# Altium project Diverter.PrjPcb
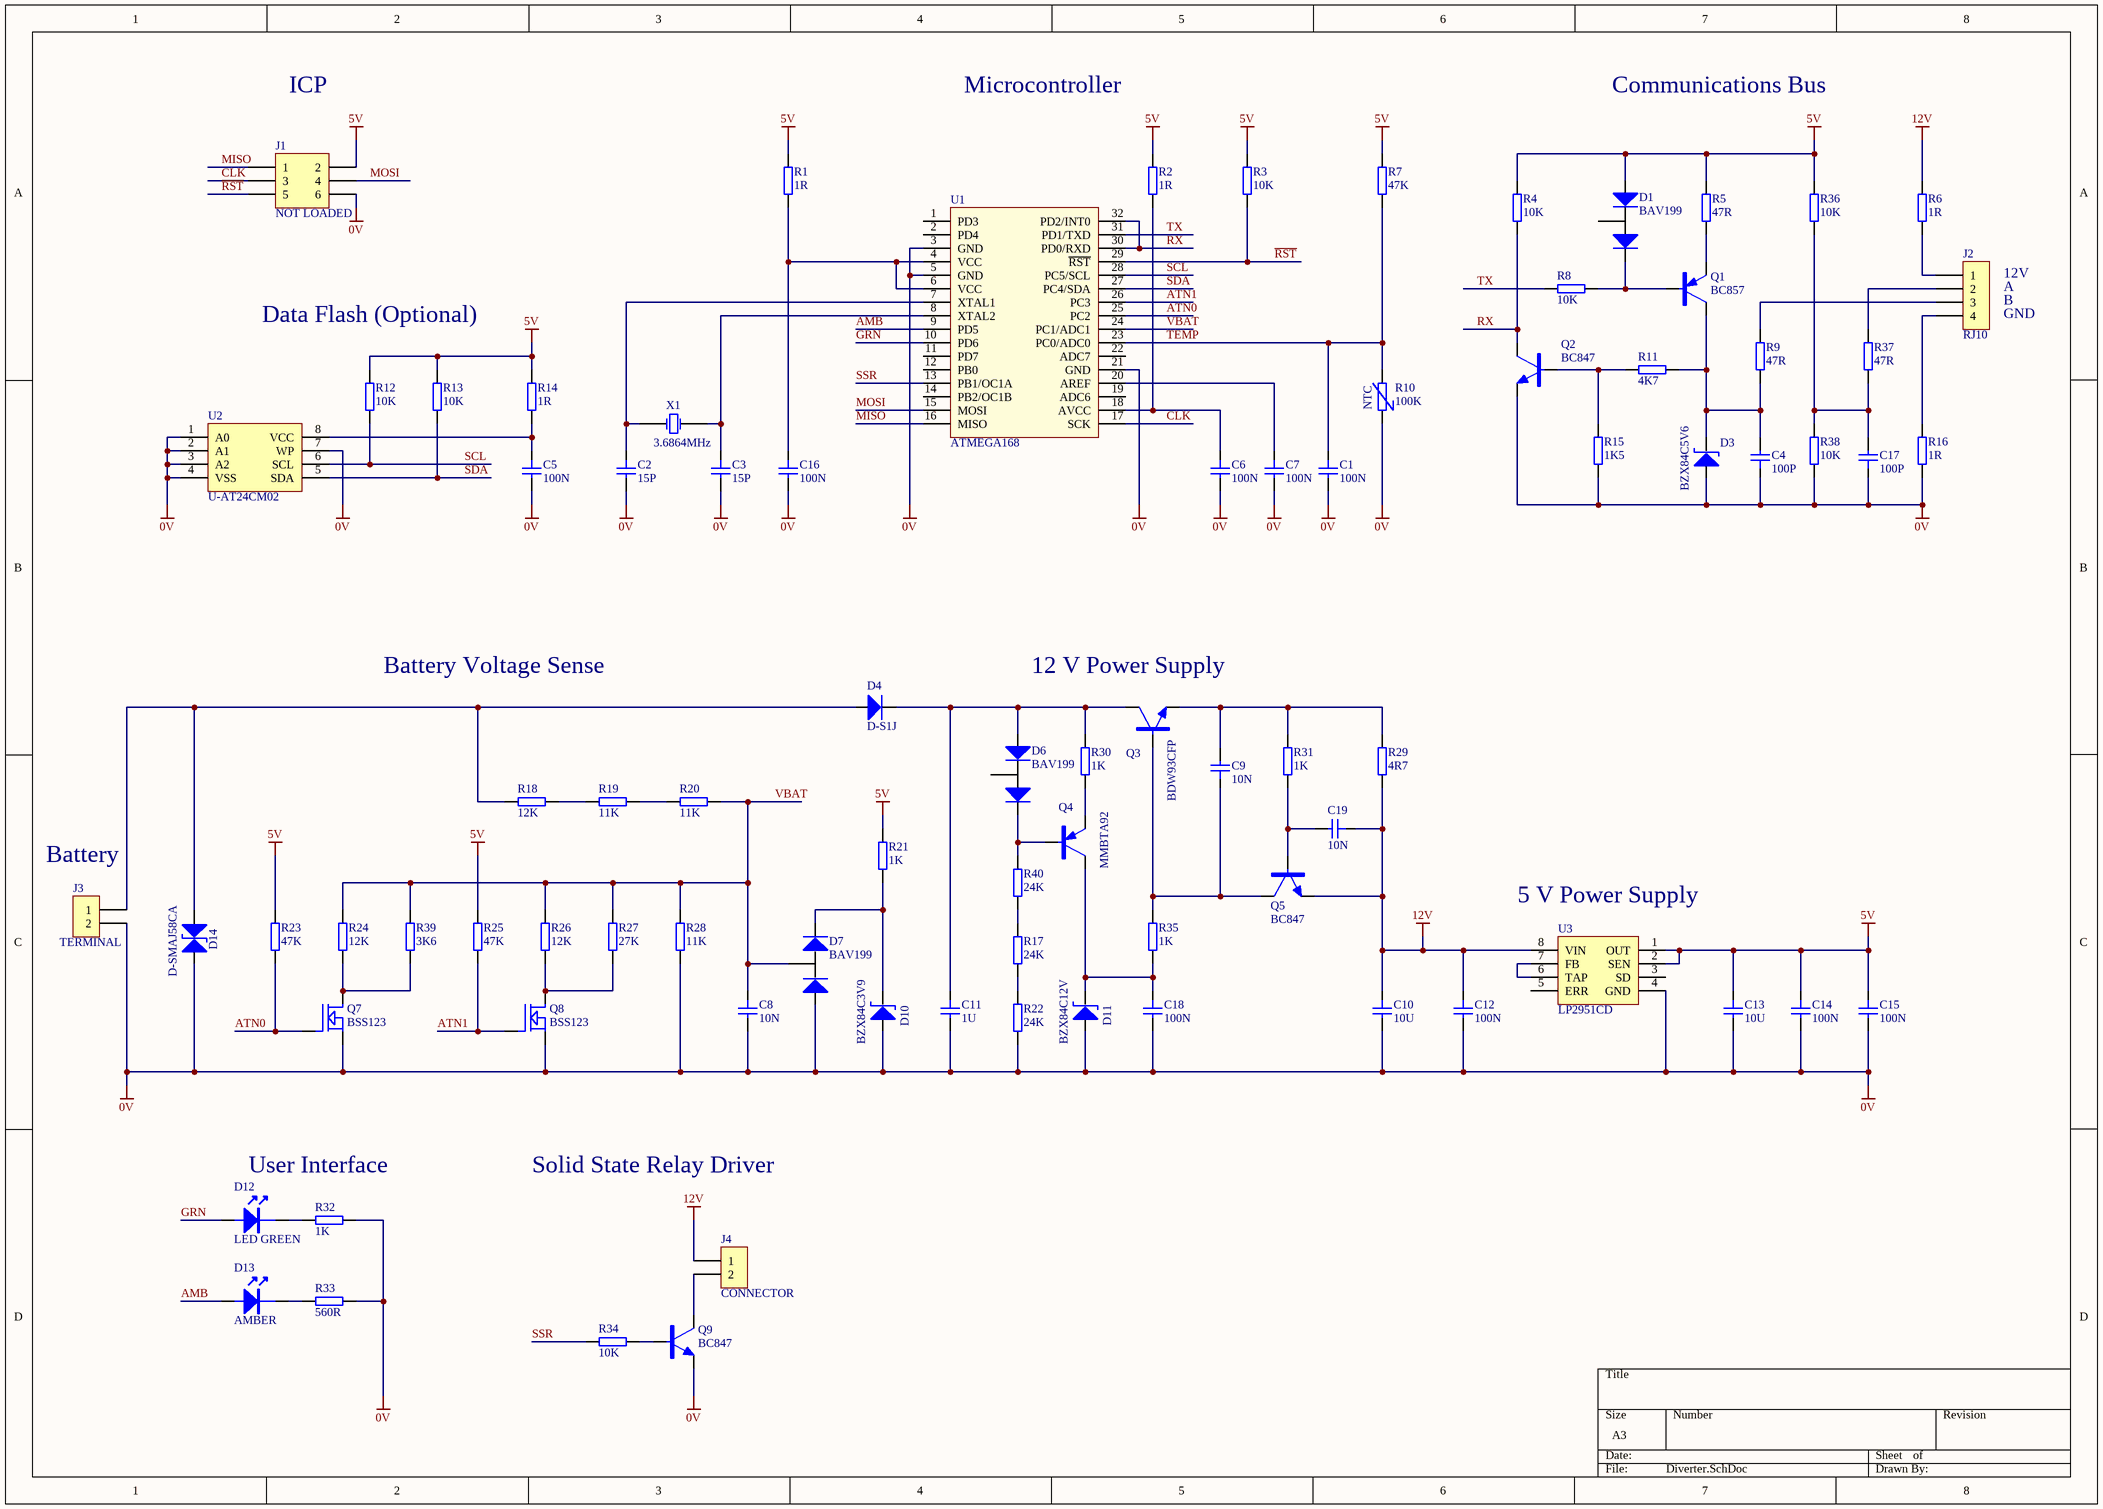
[diagram p0: Diverter.SchDoc]
1 sheet, 85 parts. Net scope: global (net labels, ports and power ports of the same name join across sheets).
Board file: Diverter.PcbDoc

## Sheet Diverter.SchDoc: Diverter
size A3; Revision: 1.0

### Parts
C1  100N  [0805]
C2  15P  [0805]
C3  15P  [0805]
C4  100P  [0805]
C5  100N  [0805]
C6  100N  [0805]
C7  100N  [0805]
C8  10N  [0805]
C9  10N  [0805]
C10  10U  [1206]
C11  1U  [1206]
C12  100N  [0805]
C13  10U  [1206]
C14  100N  [0805]
C15  100N  [0805]
C16  100N  [0805]
C17  100P  [0805]
C18  100N  [0805]
C19  10N  [0805]
D1  BAV199  [SOT23]
D3  BZX84C5V6  [SOT23]
D4  D-S1J  [SMA]
D6  BAV199  [SOT23]
D7  BAV199  [SOT23]
D10  BZX84C3V9  [SOT23]
D11  BZX84C12V  [SOT23]
D12  LED GREEN  [LED5MM]
D13  AMBER  [LED5MM]
D14  D-SMAJ58CA  [SMA]
J1  NOT LOADED  [HDR3X2]
J2  RJ10  [MOLEX85513]
J3  TERMINAL  [CTB9308]
J4  CONNECTOR  [CON2RA]
Q1  BC857  [SOT23]
Q2  BC847  [SOT23]
Q3  BDW93CFP  [TO220F]
Q4  MMBTA92  [SOT23]
Q5  BC847  [SOT23]
Q7  BSS123  [SOT23]
Q8  BSS123  [SOT23]
Q9  BC847  [SOT23]
R1  1R  [0805]
R2  1R  [0805]
R3  10K  [0805]
R4  10K  [0805]
R5  47R  [0805]
R6  1R  [0805]
R7  47K  [0805]
R8  10K  [0805]
R9  47R  [0805]
R10  100K  [0805]
R11  4K7  [0805]
R12  10K  [0805]
R13  10K  [0805]
R14  1R  [0805]
R15  1K5  [0805]
R16  1R  [0805]
R17  24K  [1206]
R18  12K  [1206]
R19  11K  [1206]
R20  11K  [1206]
R21  1K  [0805]
R22  24K  [1206]
R23  47K  [0805]
R24  12K  [0805]
R25  47K  [0805]
R26  12K  [0805]
R27  27K  [0805]
R28  11K  [1206]
R29  4R7  [1206]
R30  1K  [0805]
R31  1K  [0805]
R32  1K  [0805]
R33  560R  [0805]
R34  10K  [0805]
R35  1K  [0805]
R36  10K  [0805]
R37  47R  [0805]
R38  10K  [0805]
R39  3K6  [0805]
R40  24K  [1206]
U1  ATMEGA168  [TQFP32]
U2  U-AT24CM02  [SO8]
U3  LP2951CD  [SO8]
X1  3.6864MHz  [HC49]

### Nets
0V: C1.1 C2.1 C3.1 C4.2 C5.1 C6.1 C7.1 C8.1 C10.1 C11.1 C12.1 C13.1 C14.1 C15.1 C16.1 C17.2 C18.1 D3.1(A) D7.1(A) D10.1(A) D11.1(A) D14.1(A) J1.6 J3.2 Q2.2(E) Q7.2(S) Q8.2(S) Q9.2(E) R10.1 R15.1 R16.1 R22.2 R28.1 R32.2 R33.2 R38.1 U1.3(GND) U1.5(GND) U1.21(GND) U2.1(A0) U2.2(A1) U2.3(A2) U2.4(VSS) U2.7(WP) U3.4(GND)
5V: C13.2 C14.2 C15.2 D1.1(A) J1.2 R1.2 R2.2 R3.2 R4.2 R5.2 R7.2 R12.2 R13.2 R14.2 R21.2 R23.2 R25.2 R36.2 U3.1(OUT) U3.2(SEN)
12V: C10.2 C12.2 C19.2 J4.1 Q5.2(E) R6.2 R29.2 U3.8(VIN)
AMB: D13.1(A) U1.9(PD5)
ATN0: Q7.1(G) R23.1 U1.25(PC2)
ATN1: Q8.1(G) R25.1 U1.26(PC3)
CLK: J1.3 U1.17(SCK)
GRN: D12.1(A) U1.10(PD6)
MISO: J1.1 U1.16(MISO)
MOSI: J1.4 U1.15(MOSI)
~{RST}: J1.5 R3.1 U1.29(~{RST})
RX: Q2.3(C) R4.1 U1.30(PD0/RXD) U1.32(PD2/INT0)
SCL: R12.1 U1.28(PC5/SCL) U2.6(SCL)
SDA: R13.1 U1.27(PC4/SDA) U2.5(SDA)
SSR: R34.2 U1.13(PB1/OC1A)
TEMP: C1.2 R7.1 R10.2 U1.23(PC0/ADC0)
TX: R8.2 U1.31(PD1/TXD)
VBAT: C8.2 D7.3(C) R20.1 R24.2 R26.2 R27.2 R28.2 R39.2 U1.24(PC1/ADC1)
NetC2_2: C2.2 U1.7(XTAL1) X1.1(OSC1)
NetC3_2: C3.2 U1.8(XTAL2) X1.2(OSC2)
NetC4_1: C4.1 D3.3(K) Q1.3(C) R9.1 R11.2
NetC5_2: C5.2 R14.1 U2.8(VCC)
NetC6_2: C6.2 R2.1 U1.18(AVCC)
NetC7_2: C7.2 U1.20(AREF)
NetC9_1: C9.1 Q3.3(E) R29.1 R31.2
NetC9_2: C9.2 Q3.1(B) Q5.3(C) R35.1
NetC11_2: C11.2 D4.2(K) D6.1(A) Q3.2(C) R30.2
NetC16_2: C16.2 R1.1 U1.4(VCC) U1.6(VCC)
NetC17_1: C17.1 R36.1 R37.1 R38.2
NetC18_2: C18.2 D11.3(K) Q4.3(C) R35.2
NetC19_1: C19.1 Q5.1(B) R31.1
NetD1_2: D1.2(K) Q1.1(B) R8.1
NetD4_1: D4.1(A) D14.2(K) J3.1 R18.1
NetD6_2: D6.2(K) Q4.1(B) R40.1
NetD7_2: D7.2(K) D10.3(K) R21.1
NetD12_2: D12.2(K) R32.1
NetD13_2: D13.2(K) R33.1
NetJ2_1: J2.1 R6.1
NetJ2_2: J2.2 R37.2
NetJ2_3: J2.3 R9.2
NetJ2_4: J2.4 R16.2
NetJ4_2: J4.2 Q9.3(C)
NetQ1_2: Q1.2(E) R5.1
NetQ2_1: Q2.1(B) R11.1 R15.2
NetQ4_2: Q4.2(E) R30.1
NetQ7_3: Q7.3(D) R24.1 R39.1
NetQ8_3: Q8.3(D) R26.1 R27.1
NetQ9_1: Q9.1(B) R34.1
NetR17_1: R17.1 R40.2
NetR17_2: R17.2 R22.1
NetR18_2: R18.2 R19.2
NetR19_1: R19.1 R20.2
NetU3_6: U3.6(TAP) U3.7(FB)

Not connected (* = marked no-connect by the designer): D1 3(C); D6 3(C); U1 1(PD3) 2(PD4) 11(PD7) 12(PB0) 14(PB2/OC1B) 19(ADC6) 22(ADC7); U3 3(SD) 5(ERR)

### Notes on the sheet
- ICP
- Microcontroller
- Communications Bus
- (near J2) A
- (near J2) B
- (near J2) GND
- (near J2) 12V
- Data Flash (Optional)
- Battery Voltage Sense
- (near Q3) 12 V Power Supply
- (near J3) Battery
- (near U3) 5 V Power Supply
- User Interface
- Solid State Relay Driver
- (in symbol R-NTC100K) NTC

### Library data of the parts
C1 C5-C7 C12 C14-C16 C18 = C-B100N: CAPACITOR; Detail: 25 V; Cost: *; Order: *
C2 C3 = C-B15P: CAPACITOR; Detail: 25 V; Cost: *; Order: *
C4 C17 = C-B100P: CAPACITOR; Detail: 25 V; Cost: *; Order: *
C8 C9 C19 = C-B10N: CAPACITOR; Detail: 25 V; Cost: *; Order: *
C10 C13 = C-C10U: CAPACITOR; Detail: 35 V
C11 = C-D1U: CAPACITOR; Detail: 100V
D1 D6 D7 = D-BAV199: DUAL DIODE; Detail: BAV199
D3 = D-BZX84C5V6: ZENER DIODE; Detail: BZX84C5V6; Order: *; Cost: 0.027
D4 = D-S1J: DIODE; Detail: FAIRCHILD S1J; Order: (DK) S1JFSTR-ND; Cost: 0.0384
D10 = D-BZX84C3V9: ZENER DIODE; Detail: BZX84C3V9; Order: *; Cost: 0.027
D11 = D-BZX84C12V: ZENER DIODE; Detail: BZX84C12V; Order: *; Cost: 0.027
D12 = O-GREEN: LED; Order: (DK) C503B-GAN-CB0F0791-ND; Detail: CREE C503B-GAN-CB0F0791; Cost: 0.15
D13 = O-AMBER: LED; Order: (DK) C503B-AAN-CY0B0251-ND; Detail: CREE C503B-AAN-CY0B0251; Cost: 0.15
D14 = D-SMAJ58CA: ZENER DIODE; Detail: *
J1 = J-HDR2X3: CONNECTOR; Order: CREST BH2I-06; Cost: 0.03; Detail: NOT LOADED
J2 = J-RJ10: CONNECTOR; Detail: MOLEX 85513-5116
J3 = J-CON2VRT: CONNECTOR; Detail: CAMDENBOSS CTB9208/2 AND CTB9308/2
J4 = J-SSR: Detail: MULTICOMP  MC34641
Q1 = Q-BC857: TRANSISTOR PNP
Q2 Q5 Q9 = Q-BC847: TRANSISTOR NPN
Q3 = Q-BDW93CFP: TRANSISTOR NPN; Order: (DK)
Q4 = Q-MMBTA92: TRANSISTOR PNP
Q7 Q8 = Q-BSS123: N CH MOSFET
R1 R2 R6 R14 R16 = R-B1R: RESISTOR; Detail: *; Order: *; Cost: *
R3 R4 R8 R12 R13 R34 R36 R38 = R-B10K: RESISTOR; Detail: *; Order: *; Cost: *
R5 R9 R37 = R-B47R: RESISTOR; Detail: *; Order: *; Cost: *
R7 R23 R25 = R-B47K: RESISTOR; Detail: *; Order: *; Cost: *
R10 = R-NTC100K: THERMISTOR; Order: (DK) 490-2451-1-ND; Detail: MURATA NCP21WF104J03RA; Cost: 0.20
R11 = R-B4K7: RESISTOR; Detail: *; Order: *; Cost: *
R15 = R-B1K5: RESISTOR; Detail: *; Order: *; Cost: *
R17 R22 R40 = R-C24K: RESISTOR; Detail: *; Order: *; Cost: *
R18 = R-C12K: RESISTOR; Detail: *; Order: *; Cost: *
R19 R20 R28 = R-C11K: RESISTOR; Detail: *; Order: *; Cost: *
R21 R30-R32 R35 = R-B1K: RESISTOR; Detail: *; Order: *; Cost: *
R24 R26 = R-B12K: RESISTOR; Detail: *; Order: *; Cost: *
R27 = R-B27K: RESISTOR; Detail: *; Order: *; Cost: *
R29 = R-C4R7: RESISTOR; Detail: *; Order: *; Cost: *
R33 = R-B560R: RESISTOR; Detail: *; Order: *; Cost: *
R39 = R-B3K6: RESISTOR; Detail: *; Order: *; Cost: *
U1 = U-ATMEGA168: MICROCONTROLLER; Order: (DK) ATMEGA168A-AURTR-ND; Detail: ATMEGA168A-AUR; Cost: 1.45
U2 = U-AT24CM02-SSHD-B: I2C 2MBIT EEPROM; Detail: AT24CM02-SSHD-B
U3 = U-LP2951CD: VOLTAGE REGULATOR 5V
X1 = X-3M6864: CRYSTAL; Detail: ABRACON ABLS-3.6864MHZ-B2-T; Order: (DK) 535-9082-2-ND; Cost: 0.21